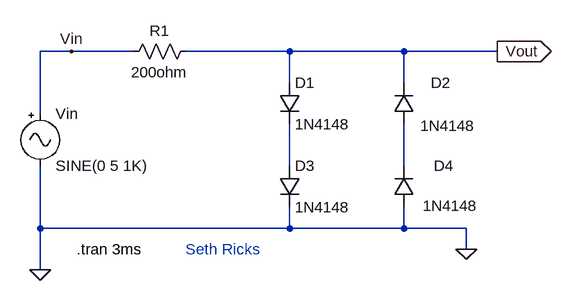
[diagram p0: schematic Diodes Circuits HW 2.asc]
Diodes Circuits HW 2.asc, the LTspice schematic file:
Version 4
SHEET 1 880 680
WIRE 80 32 32 32
WIRE 176 32 80 32
WIRE 416 32 256 32
WIRE 592 32 416 32
WIRE 736 32 592 32
WIRE 416 80 416 32
WIRE 592 80 592 32
WIRE 32 128 32 32
WIRE 416 208 416 144
WIRE 592 208 592 144
WIRE 32 304 32 208
WIRE 416 304 416 272
WIRE 416 304 32 304
WIRE 592 304 592 272
WIRE 592 304 416 304
WIRE 688 304 592 304
WIRE 688 336 688 304
WIRE 32 368 32 304
FLAG 32 368 0
FLAG 688 336 0
FLAG 736 32 Vout
IOPIN 736 32 Out
FLAG 80 32 Vin
SYMBOL Misc\\signal 32 112 R0
WINDOW 123 0 0 Left 0
WINDOW 39 0 0 Left 0
SYMATTR InstName Vin
SYMATTR Value SINE(0 5 1K)
SYMBOL diode 400 80 R0
SYMATTR InstName D1
SYMATTR Value 1N4148
SYMBOL diode 608 144 R180
WINDOW 0 -56 64 Left 2
WINDOW 3 -94 -2 Left 2
SYMATTR InstName D2
SYMATTR Value 1N4148
SYMBOL diode 400 208 R0
SYMATTR InstName D3
SYMATTR Value 1N4148
SYMBOL diode 608 272 R180
WINDOW 0 -61 64 Left 2
WINDOW 3 -98 3 Left 2
SYMATTR InstName D4
SYMATTR Value 1N4148
SYMBOL res 272 16 R90
WINDOW 0 0 56 VBottom 2
WINDOW 3 32 56 VTop 2
SYMATTR InstName R1
SYMATTR Value 200ohm
TEXT 88 336 Left 2 !.tran 3ms
TEXT 256 336 Left 2 ;Seth Ricks

The netlist it stands for:
* Diodes Circuits HW 2.asc
Vin Vin 0 SINE(0 5 1K)
D1 Vout N001 1N4148
D2 N002 Vout 1N4148
D3 N001 0 1N4148
D4 0 N002 1N4148
R1 Vout Vin 200ohm
.model D D
.lib standard.dio
.tran 3ms
* Seth Ricks
.backanno
.end

* Results of the author's LTspice run, read from the files saved beside the schematic
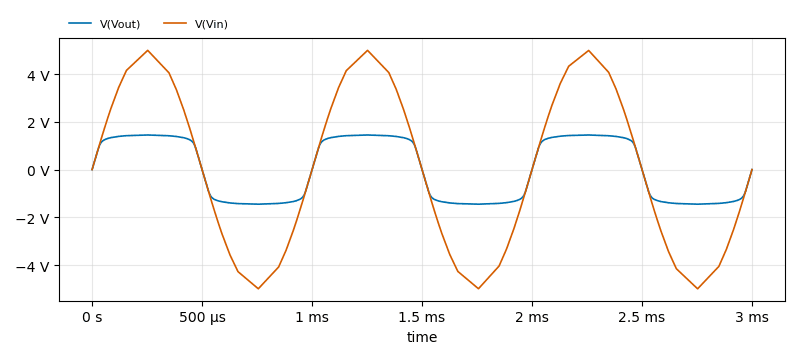
[diagram p1: Transient Analysis of Diodes Circuits HW 2.asc, plotted from the saved traces]
* Transient Analysis, 1 run:
*   V(Vout): min -1.45 V, max 1.45 V, average -15.42 µV, rms 1.298 V, last -23.64 µV
*   V(Vin): min -4.995 V, max 4.996 V, average -428.1 µV, rms 3.472 V, last 0 V